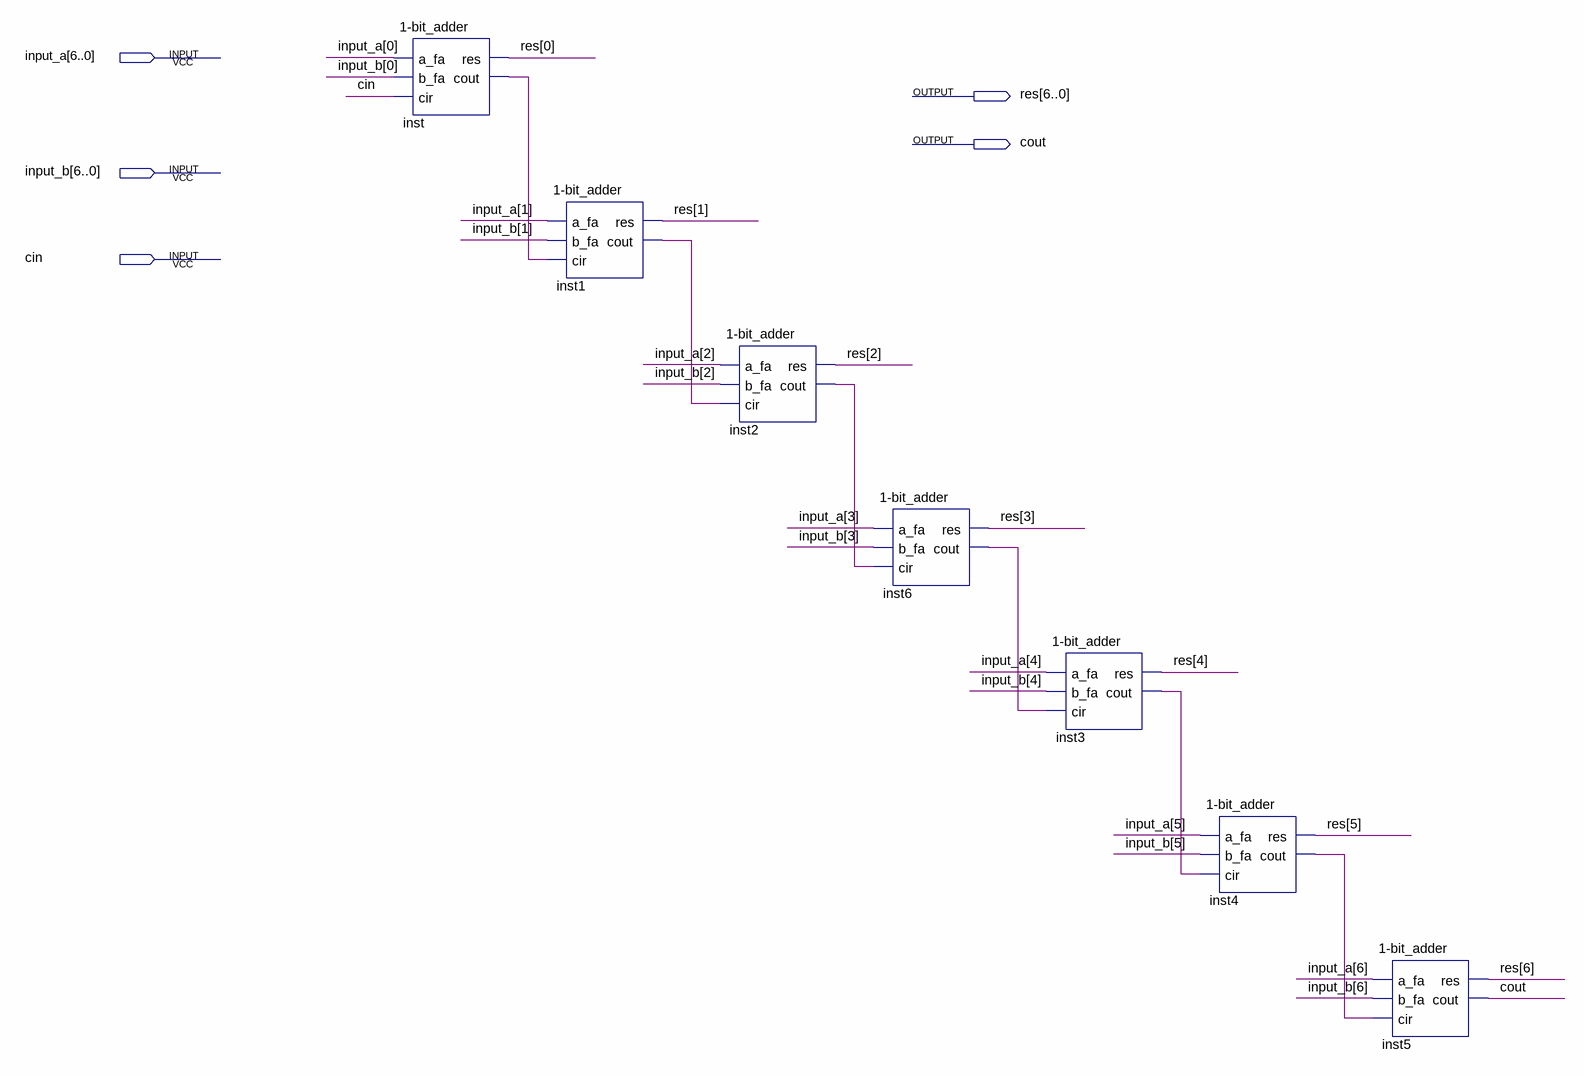
[diagram p0: schematic sheet]
// Quartus schematic unsigned_adder.bdf as structural Verilog: 7 symbols, 5 pins
module unsigned_adder (
  input  [6:0] input_a,
  input  [6:0] input_b,
  input  cin,
  output [6:0] res,
  output cout
);

  wire inst1_cout, inst2_cout, inst3_cout, inst4_cout, inst6_cout, inst_cout;

  \1-bit_adder  inst (.a_fa(input_a[0]), .b_fa(input_b[0]), .cir(cin), .res(res[0]), .cout(inst_cout));
  \1-bit_adder  inst1 (.a_fa(input_a[1]), .b_fa(input_b[1]), .cir(inst_cout), .res(res[1]), .cout(inst1_cout));
  \1-bit_adder  inst2 (.a_fa(input_a[2]), .b_fa(input_b[2]), .cir(inst1_cout), .res(res[2]), .cout(inst2_cout));
  \1-bit_adder  inst6 (.a_fa(input_a[3]), .b_fa(input_b[3]), .cir(inst2_cout), .res(res[3]), .cout(inst6_cout));
  \1-bit_adder  inst3 (.a_fa(input_a[4]), .b_fa(input_b[4]), .cir(inst6_cout), .res(res[4]), .cout(inst3_cout));
  \1-bit_adder  inst4 (.a_fa(input_a[5]), .b_fa(input_b[5]), .cir(inst3_cout), .res(res[5]), .cout(inst4_cout));
  \1-bit_adder  inst5 (.a_fa(input_a[6]), .b_fa(input_b[6]), .cir(inst4_cout), .res(res[6]), .cout(cout));
endmodule
